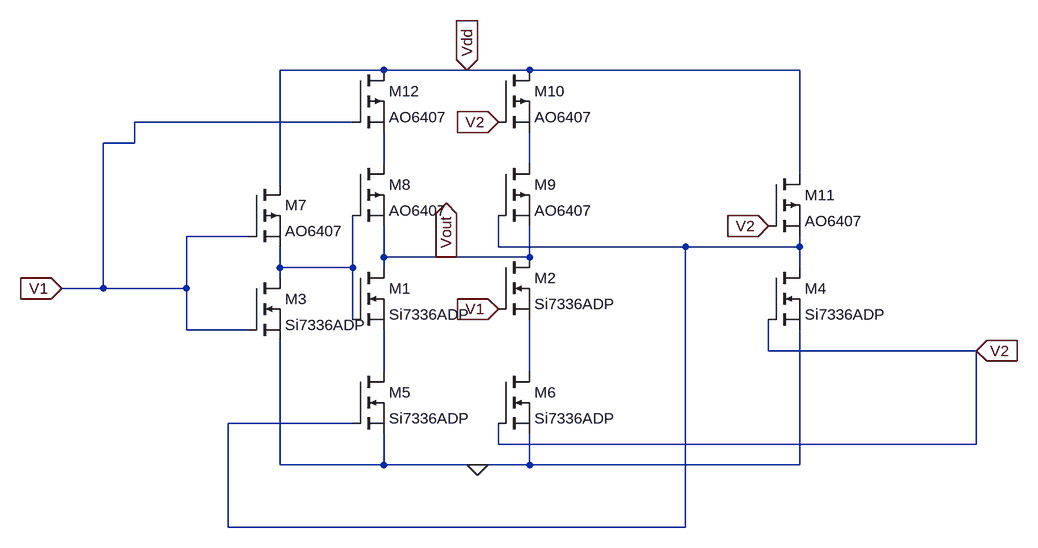
[diagram p0: schematic myxor.asc]
myxor.asc, the LTspice schematic file:
Version 4
SHEET 1 1156 680
WIRE 144 -272 -16 -272
WIRE 272 -272 144 -272
WIRE 368 -272 272 -272
WIRE 784 -272 368 -272
WIRE 96 -192 -240 -192
WIRE -240 -160 -240 -192
WIRE -240 -160 -288 -160
WIRE 144 -128 144 -176
WIRE 368 -128 368 -176
WIRE 784 -112 784 -272
WIRE -16 -96 -16 -272
WIRE -64 -16 -160 -16
WIRE 320 0 320 -48
WIRE 608 0 320 0
WIRE 784 0 784 -16
WIRE 784 0 608 0
WIRE 144 16 144 -32
WIRE 240 16 144 16
WIRE 368 16 368 -32
WIRE 368 16 240 16
WIRE -16 32 -16 0
WIRE 96 32 96 -48
WIRE 96 32 -16 32
WIRE 144 32 144 16
WIRE 784 32 784 0
WIRE -16 48 -16 32
WIRE -288 64 -288 -160
WIRE -288 64 -352 64
WIRE -160 64 -160 -16
WIRE -160 64 -288 64
WIRE 96 112 96 32
WIRE -160 128 -160 64
WIRE -64 128 -160 128
WIRE 736 160 736 112
WIRE 1056 160 736 160
WIRE 144 192 144 128
WIRE 368 192 368 112
WIRE 96 272 -96 272
WIRE 320 304 320 272
WIRE 1056 304 1056 160
WIRE 1056 304 320 304
WIRE -16 336 -16 144
WIRE 144 336 144 288
WIRE 144 336 -16 336
WIRE 288 336 144 336
WIRE 368 336 368 288
WIRE 368 336 288 336
WIRE 784 336 784 128
WIRE 784 336 368 336
WIRE -96 432 -96 272
WIRE 608 432 608 0
WIRE 608 432 -96 432
FLAG 288 336 0
FLAG -352 64 V1
IOPIN -352 64 In
FLAG 320 96 V1
IOPIN 320 96 In
FLAG 1056 160 V2
IOPIN 1056 160 In
FLAG 736 -32 V2
IOPIN 736 -32 In
FLAG 272 -272 Vdd
IOPIN 272 -272 In
FLAG 240 16 Vout
IOPIN 240 16 Out
FLAG 320 -192 V2
IOPIN 320 -192 In
SYMBOL nmos 96 32 R0
SYMATTR InstName M1
SYMATTR Value Si7336ADP
SYMBOL nmos 320 16 R0
SYMATTR InstName M2
SYMATTR Value Si7336ADP
SYMBOL nmos -64 48 R0
SYMATTR InstName M3
SYMATTR Value Si7336ADP
SYMBOL nmos 736 32 R0
SYMATTR InstName M4
SYMATTR Value Si7336ADP
SYMBOL nmos 96 192 R0
SYMATTR InstName M5
SYMATTR Value Si7336ADP
SYMBOL nmos 320 192 R0
SYMATTR InstName M6
SYMATTR Value Si7336ADP
SYMBOL pmos -64 -96 R0
SYMATTR InstName M7
SYMATTR Value AO6407
SYMBOL pmos 96 -128 R0
SYMATTR InstName M8
SYMATTR Value AO6407
SYMBOL pmos 320 -128 R0
SYMATTR InstName M9
SYMATTR Value AO6407
SYMBOL pmos 320 -272 R0
SYMATTR InstName M10
SYMATTR Value AO6407
SYMBOL pmos 736 -112 R0
SYMATTR InstName M11
SYMATTR Value AO6407
SYMBOL pmos 96 -272 R0
SYMATTR InstName M12
SYMATTR Value AO6407

The netlist it stands for:
* myxor.asc
M1 Vout N004 N005 N005 Si7336ADP
M2 Vout V1 N006 N006 Si7336ADP
M3 N004 V1 0 0 Si7336ADP
M4 N003 V2 0 0 Si7336ADP
M5 N005 N003 0 0 Si7336ADP
M6 N006 V2 0 0 Si7336ADP
M7 Vdd V1 N004 N004 AO6407
M8 N001 N004 Vout Vout AO6407
M9 N002 N003 Vout Vout AO6407
M10 Vdd V2 N002 N002 AO6407
M11 Vdd V2 N003 N003 AO6407
M12 Vdd V1 N001 N001 AO6407
.model NMOS NMOS
.model PMOS PMOS
.lib standard.mos
.backanno
.end